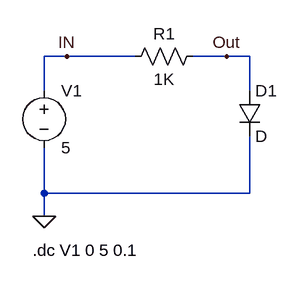
[diagram p0: schematic Draft6.asc]
Draft6.asc, the LTspice schematic file:
Version 4.1
SHEET 1 880 680
WIRE 32 -80 0 -80
WIRE 128 -80 32 -80
WIRE 256 -80 208 -80
WIRE 288 -80 256 -80
WIRE 0 -32 0 -80
WIRE 288 -32 288 -80
WIRE 0 112 0 48
WIRE 288 112 288 32
WIRE 288 112 0 112
WIRE 0 144 0 112
FLAG 0 144 0
FLAG 32 -80 IN
FLAG 256 -80 Out
SYMBOL voltage 0 -48 R0
SYMATTR InstName V1
SYMATTR Value 5
SYMBOL res 224 -96 R90
WINDOW 0 0 56 VBottom 2
WINDOW 3 32 56 VTop 2
SYMATTR InstName R1
SYMATTR Value 1K
SYMBOL diode 272 -32 R0
SYMATTR InstName D1
TEXT -16 192 Left 2 !.dc V1 0 5 0.1

The netlist it stands for:
* Draft6.asc
V1 IN 0 5
R1 Out IN 1K
D1 Out 0 D
.model D D
.lib standard.dio
.dc V1 0 5 0.1
.backanno
.end